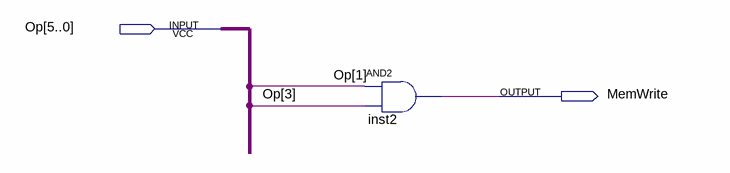
[diagram p0: schematic sheet]
// Quartus schematic MemWriteDecoder.bdf as structural Verilog: 1 symbols, 2 pins
module MemWriteDecoder (
  input  [5:0] Op,
  output MemWrite
);

  and inst2 (MemWrite, Op[1], Op[3]);
endmodule
